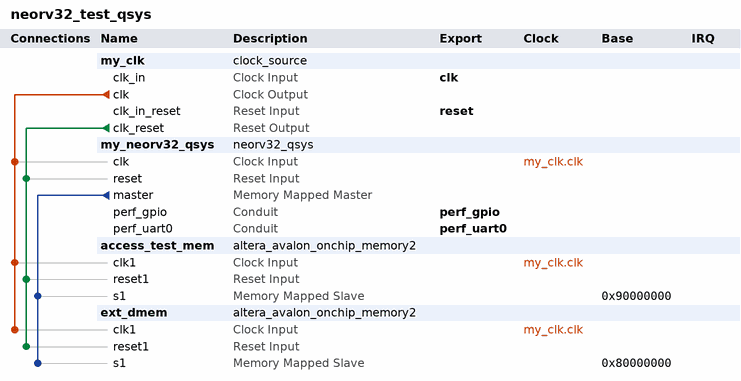
[diagram p0: system contents]
# Platform Designer (Qsys) system neorv32_test_qsys, Cyclone IV E EP4CE22F17C6
# Parameters at their usual value, and those the tool derives, are not listed.
package require -exact qsys 18.1
create_system neorv32_test_qsys
set_project_property DEVICE_FAMILY {Cyclone IV E}
set_project_property DEVICE EP4CE22F17C6

add_instance my_clk clock_source 18.1
set_instance_parameter_value my_clk clockFrequency 50000000
set_instance_parameter_value my_clk resetSynchronousEdges DEASSERT

add_instance my_neorv32_qsys neorv32_qsys 1.0
set_instance_parameter_value my_neorv32_qsys CLOCK_RATE_CLK 50000000
set_instance_parameter_value my_neorv32_qsys GUI_DMEM_SIZE 8
set_instance_parameter_value my_neorv32_qsys GUI_IMEM_SIZE 16
set_instance_parameter_value my_neorv32_qsys TMP_GUI_CLOCK_FREQUENCY 100000000
set_instance_parameter_value my_neorv32_qsys TMP_GUI_ENABLE_AVALONMM true
set_instance_parameter_value my_neorv32_qsys TMP_GUI_ENABLE_BOOTLOADER false
set_instance_parameter_value my_neorv32_qsys TMP_GUI_ENABLE_GPIO true
set_instance_parameter_value my_neorv32_qsys TMP_GUI_ENABLE_INTERNAL_DMEM true
set_instance_parameter_value my_neorv32_qsys TMP_GUI_ENABLE_INTERNAL_IMEM true
set_instance_parameter_value my_neorv32_qsys TMP_GUI_ENABLE_UART0 true
set_instance_parameter_value my_neorv32_qsys TMP_GUI_ENABLE_UART1 false

add_instance access_test_mem altera_avalon_onchip_memory2 18.1
set_instance_parameter_value access_test_mem dataWidth 32
set_instance_parameter_value access_test_mem dualPort false
set_instance_parameter_value access_test_mem initMemContent false
set_instance_parameter_value access_test_mem initializationFileName onchip_mem.hex
set_instance_parameter_value access_test_mem memorySize 4096
set_instance_parameter_value access_test_mem resetrequest_enabled false
set_instance_parameter_value access_test_mem slave1Latency 2

add_instance ext_dmem altera_avalon_onchip_memory2 18.1
set_instance_parameter_value ext_dmem dataWidth 32
set_instance_parameter_value ext_dmem dualPort false
set_instance_parameter_value ext_dmem initMemContent false
set_instance_parameter_value ext_dmem initializationFileName onchip_mem.hex
set_instance_parameter_value ext_dmem memorySize 8192
set_instance_parameter_value ext_dmem resetrequest_enabled false
set_instance_parameter_value ext_dmem slave1Latency 2

# connections
add_connection my_clk.clk access_test_mem.clk1 clock
add_connection my_clk.clk ext_dmem.clk1 clock
add_connection my_clk.clk my_neorv32_qsys.clk clock
add_connection my_clk.clk_reset access_test_mem.reset1 reset
add_connection my_clk.clk_reset ext_dmem.reset1 reset
add_connection my_clk.clk_reset my_neorv32_qsys.reset reset
add_connection my_neorv32_qsys.master access_test_mem.s1 avalon
set_connection_parameter_value my_neorv32_qsys.master/access_test_mem.s1 baseAddress 0x90000000
add_connection my_neorv32_qsys.master ext_dmem.s1 avalon
set_connection_parameter_value my_neorv32_qsys.master/ext_dmem.s1 baseAddress 0x80000000

# exported interfaces
add_interface clk clock sink
set_interface_property clk EXPORT_OF my_clk.clk_in
add_interface perf_gpio conduit end
set_interface_property perf_gpio EXPORT_OF my_neorv32_qsys.perf_gpio
add_interface perf_uart0 conduit end
set_interface_property perf_uart0 EXPORT_OF my_neorv32_qsys.perf_uart0
add_interface reset reset sink
set_interface_property reset EXPORT_OF my_clk.clk_in_reset

set_interconnect_requirement {$system} qsys_mm.clockCrossingAdapter HANDSHAKE
set_interconnect_requirement {$system} qsys_mm.enableEccProtection FALSE
set_interconnect_requirement {$system} qsys_mm.insertDefaultSlave FALSE
set_interconnect_requirement {$system} qsys_mm.maxAdditionalLatency 1

save_system neorv32_test_qsys.qsys
